# EAGLE design navilock-gps-to-bluetooth-converter-v1.2 (EAGLE 7.5.0)
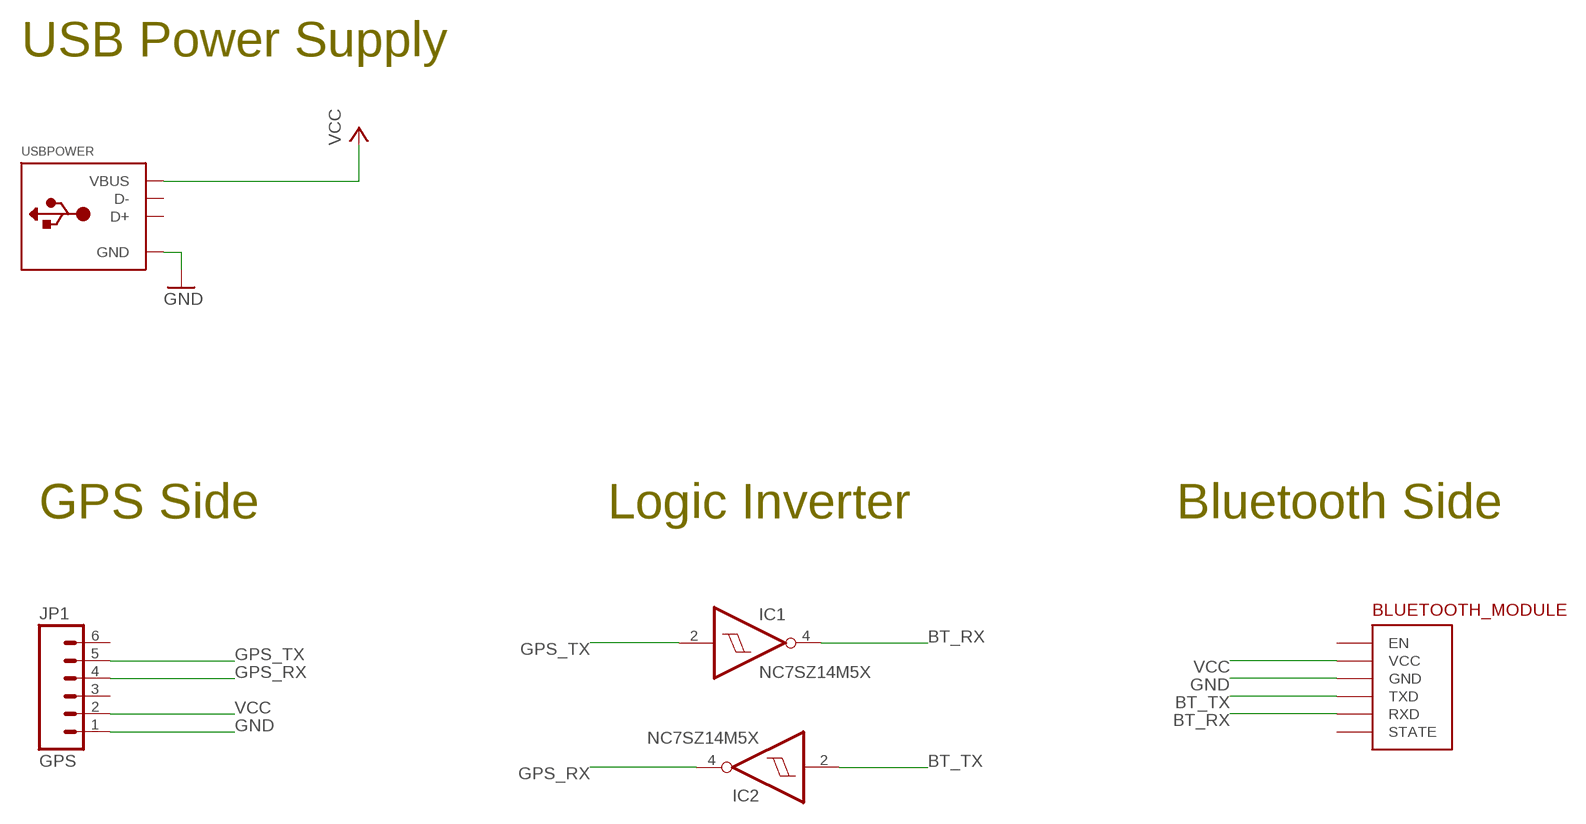
[diagram p0: schematic, sheet 1]

## Parts
BLUETOOTH_MODULE  JY-MCU-BLUETOOTHHORIZONTAL  [JY-MCU-BLUETOOTH-HORIZONTAL]
IC1  NC7SZ14M5X  [SOT23-5]
IC2  NC7SZ14M5X  [SOT23-5]
JP1  GPS  MINI-DIN6WITH-LAT-HOLES  [MINI-DIN6-WITH-LAT-HOLES]
USBPOWER  USB_TYPEA  [USB_A-SMT]

## Nets
BT_RX: BLUETOOTH_MODULE.RXD IC1.4(O)
BT_TX: BLUETOOTH_MODULE.TXD IC2.2(I)
GND: BLUETOOTH_MODULE.GND JP1.1 USBPOWER.GND
GPS_RX: IC2.4(O) JP1.4
GPS_TX: IC1.2(I) JP1.5
VCC: BLUETOOTH_MODULE.VCC JP1.2 USBPOWER.VBUS
Unconnected: BLUETOOTH_MODULE.EN BLUETOOTH_MODULE.STATE JP1.3 JP1.6 USBPOWER.D+ USBPOWER.D-

## Notes on the sheet
- USB Power Supply
- GPS Side | Logic Inverter | Bluetooth Side

## Power pins joined to a net without a drawn wire
GND: IC1.3(GND) IC2.3(GND)
VCC: IC1.5(VCC) IC2.5(VCC)

## Library data of the parts
BLUETOOTH_MODULE = kalanda:JY-MCU-BLUETOOTH
IC1 IC2 = 74xx-little-us:NC7SZ14: TinyLogic(R) UHS Inverter with Schmitt Trigger Input Source: http://www.fairchildsemi.com/ds/NC/NC7SZ14.pdf
JP1 = kalanda:MINI-DIN6
USBPOWER = microbuilder:USB_TYPEA: USB - Type A Connectors Male types stick out and are inserted into a PC or matching females parts (these are the connectors used on USB Memory Sticks, etc.). Female parts are generally used for USB Host and accept a male-type connector. SMT Male - 4UCON: 10017 PTH Female - Digikey: 609-1045-ND, 4UCon: 05241

## Net classes
1 power: width 0.254 mm

## Board
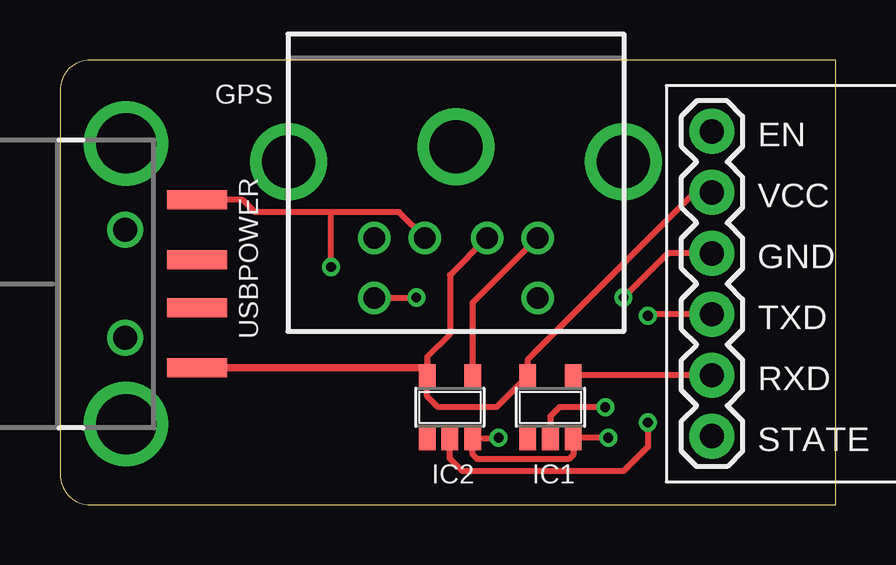
[diagram p1: board, top side]
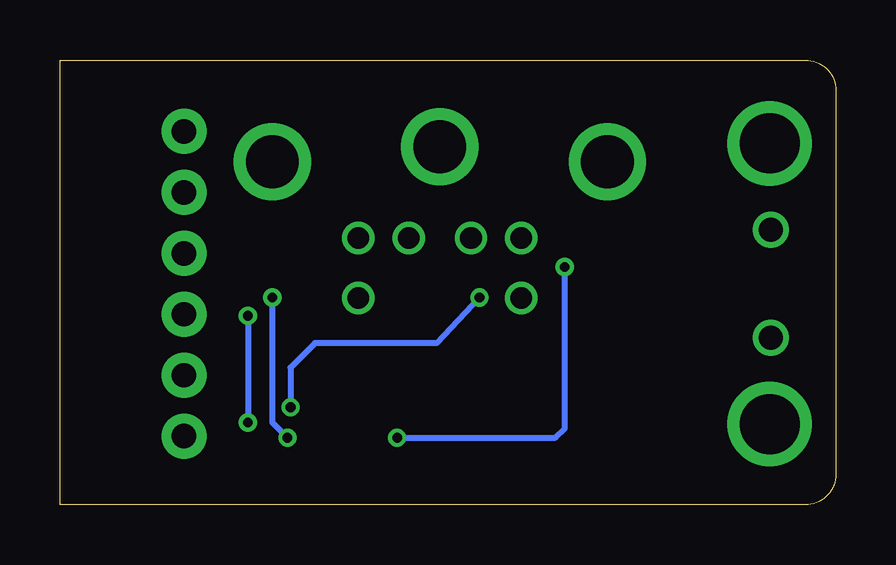
[diagram p2: board, bottom side, seen from below]

Size 32.35 x 18.53 mm. Coordinates in mm from the lower left corner, seen from the top.
Outline: 0,17.26 0,1.27 arc90 1.27,0 32.35,0 32.35,18.53 1.27,18.53 arc90 0,17.26
Copper layers (1*16): Top 0.0356mm / dielectric 1.5011mm / Bottom 0.0356mm
Design rules "LaenPCBOrder_without_tentedvias": minimum track width 6mil, minimum drill 13mil, track to track 6mil, track to pad 6mil, pad to pad 6mil, via to via 6mil, smd to smd 6mil, copper to edge 15mil, drill to drill 6mil, minimum pad ring 7mil, minimum via ring 7mil, stop-mask expansion 3mil, vias tented up to drill 30mil, thermal gap 10mil

### Footprints (pad centres in the part's own frame; a part is rotated, then mirrored left to right if it is on the bottom)
JY-MCU-BLUETOOTH-HORIZONTAL = drill 1.016 pad 1.88: EN 0,0; GND 5.08,0; RXD 10.16,0; STATE 12.7,0; TXD 7.62,0; VCC 2.54,0
SOT23-5 = smd 0.69 x 0.99: 1 -0.95,-1.29; 2 0,-1.29; 3 0.95,-1.29; 4 0.95,1.3; 5 -0.95,1.3
MINI-DIN6-WITH-LAT-HOLES = drill 0.9: 1 -1.3,-3.42; 2 1.3,-3.42; 3 -3.4,-3.42; 4 3.4,-3.42; 5 -3.4,-5.92; 6 3.4,-5.92 | drill 2.2: P$1 0,0.38; P$2 -6.985,-0.255; P$3 6.985,-0.255
USB_A-SMT = drill 2.5 pad 3.302: D1 -5.85,2.958; D2 5.85,2.958 | drill 1: D3 -2.25,3; D4 2.25,3 | smd 0.8 x 2.5: D+ 1,0; D- -1,0; GND 3.5,0; VBUS -3.5,0

### Placement (x,y rotation side)
BLUETOOTH_MODULE  27.18,15.56 270 top
IC1  20.45,4.06 0 top
IC2  16.26,4.06 0 top
JP1  16.51,14.54 0 top
USBPOWER  5.71,9.21 90 top

### Tracks (layer width: path | path; a pad name or v marks a point on that pad's centre or on a via)
BT_RX
  Top 0.254: BLUETOOTH_MODULE.RXD 21.4,5.4 IC1.4
BT_TX  (via drill 0.4)
  Top 0.254: BLUETOOTH_MODULE.TXD 24.83,7.94 v24.51,7.87 | v24.51,3.43 24.51,2.41 23.5,1.4 16.78,1.4 16.26,1.92 IC2.2
  Bottom 0.254: v24.51,7.87 v24.51,3.43
GND  (via drill 0.4)
  Top 0.254: JP1.1 14.14,12.19 11.3,12.19 | 11.3,12.19 8.13,12.19 7.62,12.7 5.72,12.7 USBPOWER.GND | BLUETOOTH_MODULE.GND 25.34,10.48 v23.5,8.64 | v22.86,2.79 21.42,2.79 IC1.3 21.4,2.09 21.21,1.91 17.4,1.91 17.21,2.1 IC2.3 18.27,2.77 v18.29,2.79 | v11.3,9.91 11.3,12.19
  Bottom 0.254: v23.5,8.64 23.5,3.43 v22.86,2.79 | v18.29,2.79 11.68,2.79 11.3,3.17 v11.3,9.91
GPS_RX
  Top 0.254: JP1.4 17.21,8.42 IC2.4
GPS_TX  (via drill 0.4)
  Top 0.254: JP1.5 14.87,8.62 v14.86,8.64 | v22.73,4.06 20.83,4.06 20.45,3.68 IC1.2
  Bottom 0.254: v14.86,8.64 16.64,6.73 21.72,6.73 22.73,5.71 v22.73,4.06
VCC
  Top 0.254: BLUETOOTH_MODULE.VCC 27.11,12.95 26.42,12.95 19.5,6.04 IC1.5 18.2,4.06 15.77,4.06 15.31,4.52 IC2.5 15.31,6.16 16.26,7.11 16.26,9.57 JP1.2
  Top 0.305: USBPOWER.VBUS 15.31,5.71 IC2.5